# EAGLE schematic 18650_tester_5 (EAGLE 9.6.2)
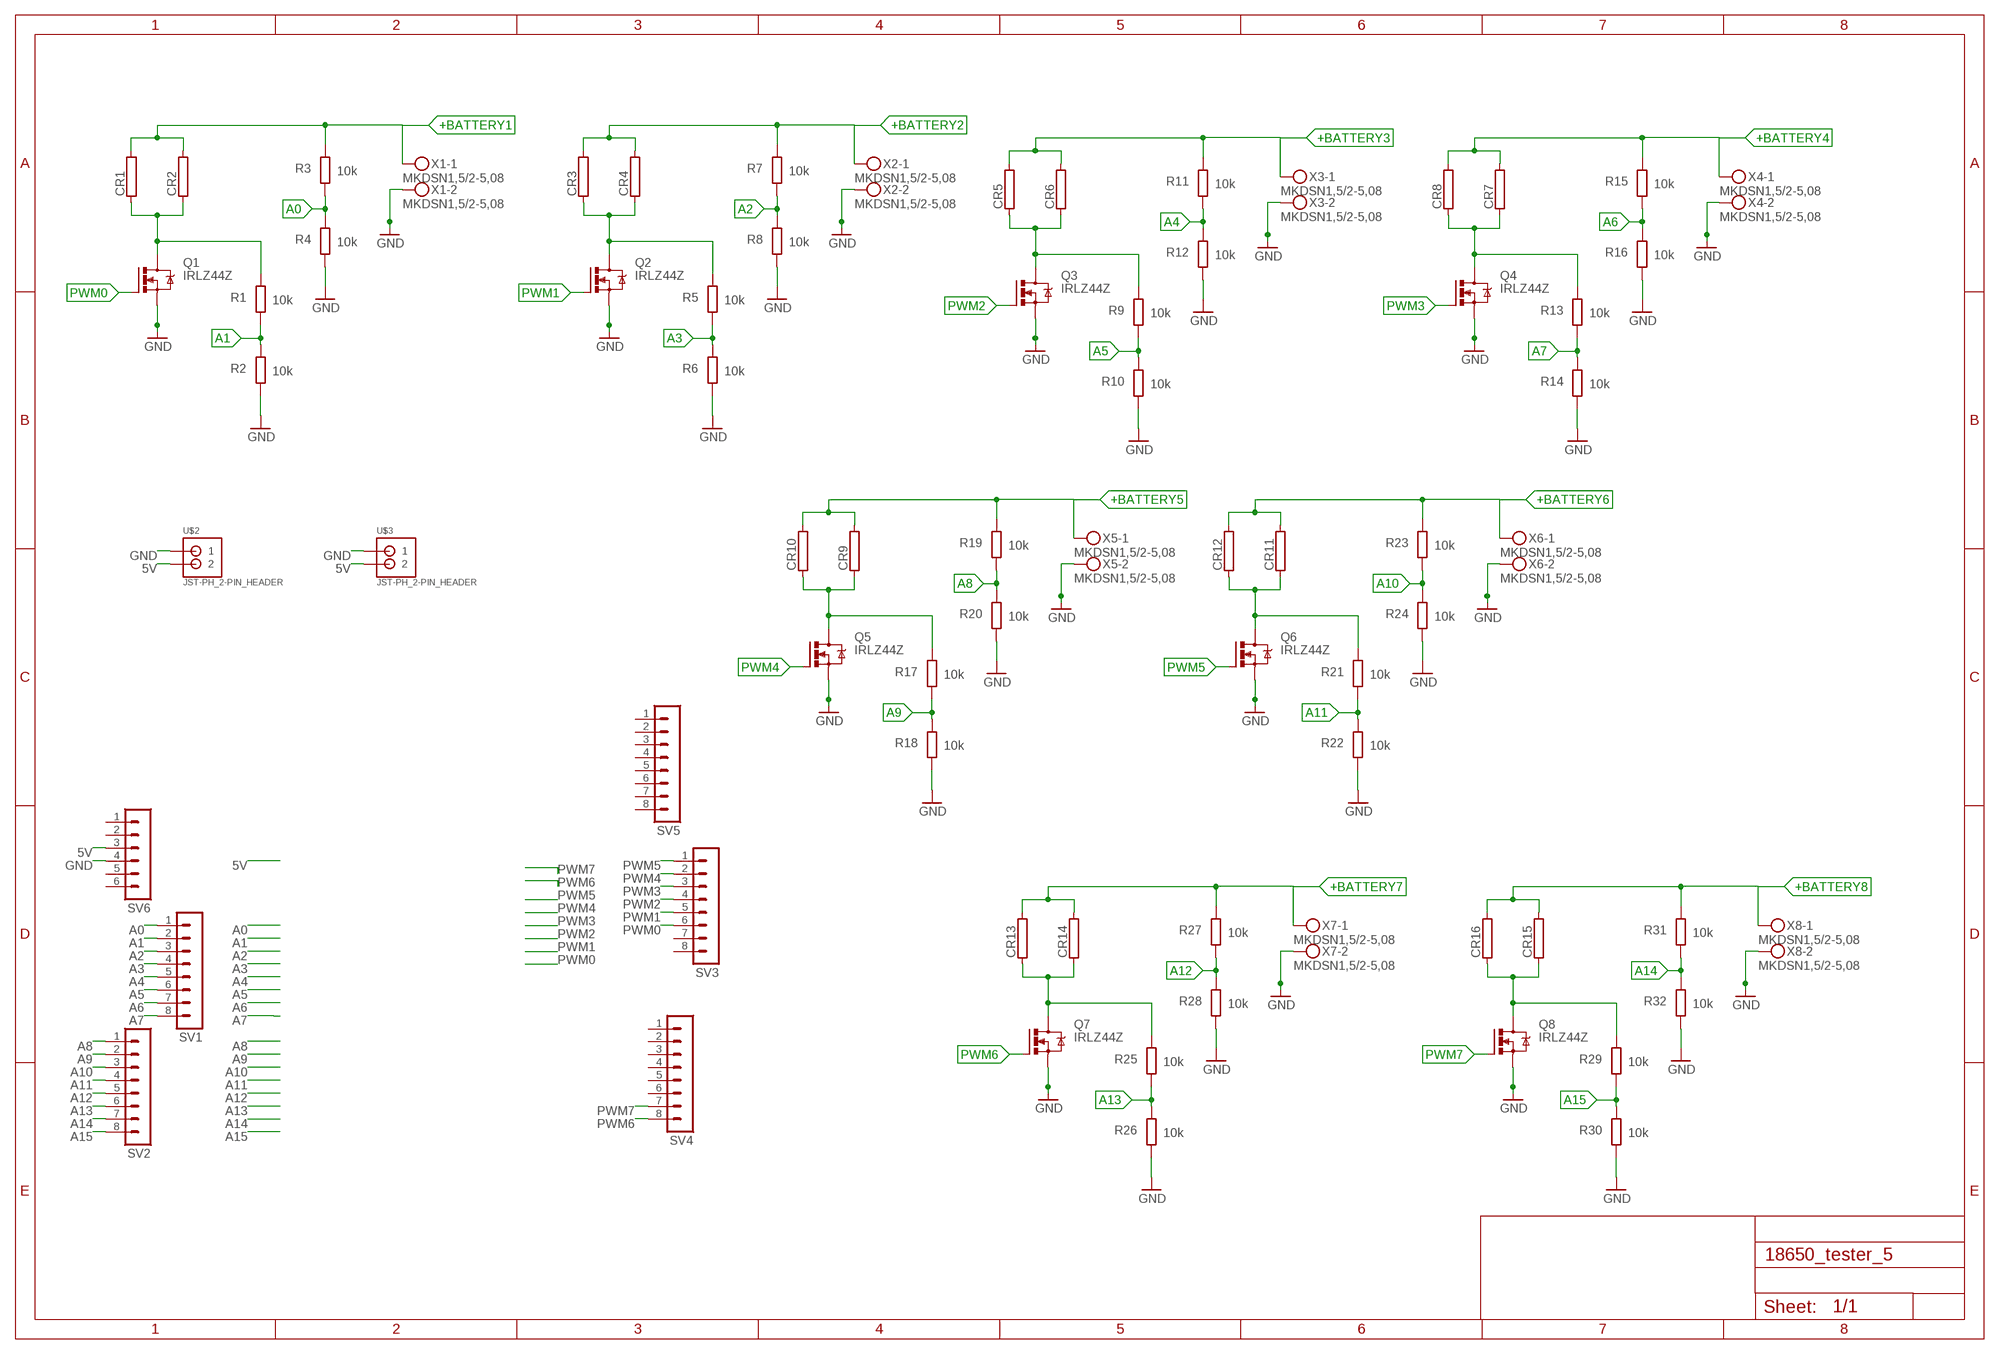
[diagram p0: schematic, sheet 1]

## Parts
CR1  RRWM6X22  [RWM6X22]
CR2  RRWM6X22  [RWM6X22]
CR3  RRWM6X22  [RWM6X22]
CR4  RRWM6X22  [RWM6X22]
CR5  RRWM6X22  [RWM6X22]
CR6  RRWM6X22  [RWM6X22]
CR7  RRWM6X22  [RWM6X22]
CR8  RRWM6X22  [RWM6X22]
CR9  RRWM6X22  [RWM6X22]
CR10  RRWM6X22  [RWM6X22]
CR11  RRWM6X22  [RWM6X22]
CR12  RRWM6X22  [RWM6X22]
CR13  RRWM6X22  [RWM6X22]
CR14  RRWM6X22  [RWM6X22]
CR15  RRWM6X22  [RWM6X22]
CR16  RRWM6X22  [RWM6X22]
Q1  IRLZ44Z  [TO220BH]
Q2  IRLZ44Z  [TO220BH]
Q3  IRLZ44Z  [TO220BH]
Q4  IRLZ44Z  [TO220BH]
Q5  IRLZ44Z  [TO220BH]
Q6  IRLZ44Z  [TO220BH]
Q7  IRLZ44Z  [TO220BH]
Q8  IRLZ44Z  [TO220BH]
R1  10k  R-EU_M1206  [M1206]
R2  10k  R-EU_M1206  [M1206]
R3  10k  R-EU_M1206  [M1206]
R4  10k  R-EU_M1206  [M1206]
R5  10k  R-EU_M1206  [M1206]
R6  10k  R-EU_M1206  [M1206]
R7  10k  R-EU_M1206  [M1206]
R8  10k  R-EU_M1206  [M1206]
R9  10k  R-EU_M1206  [M1206]
R10  10k  R-EU_M1206  [M1206]
R11  10k  R-EU_M1206  [M1206]
R12  10k  R-EU_M1206  [M1206]
R13  10k  R-EU_M1206  [M1206]
R14  10k  R-EU_M1206  [M1206]
R15  10k  R-EU_M1206  [M1206]
R16  10k  R-EU_M1206  [M1206]
R17  10k  R-EU_M1206  [M1206]
R18  10k  R-EU_M1206  [M1206]
R19  10k  R-EU_M1206  [M1206]
R20  10k  R-EU_M1206  [M1206]
R21  10k  R-EU_M1206  [M1206]
R22  10k  R-EU_M1206  [M1206]
R23  10k  R-EU_M1206  [M1206]
R24  10k  R-EU_M1206  [M1206]
R25  10k  R-EU_M1206  [M1206]
R26  10k  R-EU_M1206  [M1206]
R27  10k  R-EU_M1206  [M1206]
R28  10k  R-EU_M1206  [M1206]
R29  10k  R-EU_M1206  [M1206]
R30  10k  R-EU_M1206  [M1206]
R31  10k  R-EU_M1206  [M1206]
R32  10k  R-EU_M1206  [M1206]
SV1  MA08-1  [MA08-1]
SV2  MA08-1  [MA08-1]
SV3  MA08-1  [MA08-1]
SV4  MA08-1  [MA08-1]
SV5  MA08-1  [MA08-1]
SV6  MA06-1  [MA06-1]
U$2  JST-PH_2-PIN_HEADER  [JST_B2B-PH_HEADER]
U$3  JST-PH_2-PIN_HEADER  [JST_B2B-PH_HEADER]
X1  MKDSN1,5/2-5,08  [MKDSN1,5/2-5,08]
X2  MKDSN1,5/2-5,08  [MKDSN1,5/2-5,08]
X3  MKDSN1,5/2-5,08  [MKDSN1,5/2-5,08]
X4  MKDSN1,5/2-5,08  [MKDSN1,5/2-5,08]
X5  MKDSN1,5/2-5,08  [MKDSN1,5/2-5,08]
X6  MKDSN1,5/2-5,08  [MKDSN1,5/2-5,08]
X7  MKDSN1,5/2-5,08  [MKDSN1,5/2-5,08]
X8  MKDSN1,5/2-5,08  [MKDSN1,5/2-5,08]

## Nets
5V: SV6.3 U$2.P2 U$3.P2
+BATTERY1: CR1.2 CR2.2 R3.2 X1.1
+BATTERY2: CR3.2 CR4.2 R7.2 X2.1
+BATTERY3: CR5.2 CR6.2 R11.2 X3.1
+BATTERY4: CR7.2 CR8.2 R15.2 X4.1
+BATTERY5: CR9.2 CR10.2 R19.2 X5.1
+BATTERY6: CR11.2 CR12.2 R23.2 X6.1
+BATTERY7: CR13.2 CR14.2 R27.2 X7.1
+BATTERY8: CR15.2 CR16.2 R31.2 X8.1
A0: R3.1 R4.2 SV1.1
A1: R1.1 R2.2 SV1.2
A2: R7.1 R8.2 SV1.3
A3: R5.1 R6.2 SV1.4
A4: R11.1 R12.2 SV1.5
A5: R9.1 R10.2 SV1.6
A6: R15.1 R16.2 SV1.7
A7: R13.1 R14.2 SV1.8
A8: R19.1 R20.2 SV2.1
A9: R17.1 R18.2 SV2.2
A10: R23.1 R24.2 SV2.3
A11: R21.1 R22.2 SV2.4
A12: R27.1 R28.2 SV2.5
A13: R25.1 R26.2 SV2.6
A14: R31.1 R32.2 SV2.7
A15: R29.1 R30.2 SV2.8
GND: Q1.S Q2.S Q3.S Q4.S Q5.S Q6.S Q7.S Q8.S R2.1 R4.1 R6.1 R8.1 R10.1 R12.1 R14.1 R16.1 R18.1 R20.1 R22.1 R24.1 R26.1 R28.1 R30.1 R32.1 SV6.4 U$2.P1 U$3.P1 X1.2 X2.2 X3.2 X4.2 X5.2 X6.2 X7.2 X8.2
N$1: CR3.1 CR4.1 Q2.D R5.2
N$2: CR5.1 CR6.1 Q3.D R9.2
N$3: CR1.1 CR2.1 Q1.D R1.2
N$4: CR7.1 CR8.1 Q4.D R13.2
N$5: CR9.1 CR10.1 Q5.D R17.2
N$6: CR11.1 CR12.1 Q6.D R21.2
N$7: CR13.1 CR14.1 Q7.D R25.2
N$8: CR15.1 CR16.1 Q8.D R29.2
PWM0: Q1.G SV3.6
PWM1: Q2.G SV3.5
PWM2: Q3.G SV3.4
PWM3: Q4.G SV3.3
PWM4: Q5.G SV3.2
PWM5: Q6.G SV3.1
PWM6: Q7.G SV4.8
PWM7: Q8.G SV4.7
Unconnected: SV3.7 SV3.8 SV4.1 SV4.2 SV4.3 SV4.4 SV4.5 SV4.6 SV5.1 SV5.2 SV5.3 SV5.4 SV5.5 SV5.6 SV5.7 SV5.8 SV6.1 SV6.2 SV6.5 SV6.6

## Library data of the parts
CR1-CR16 = resistor-power:R: Power Resitor; OC_FARNELL: unknown; OC_NEWARK: unknown
Q1-Q8 = IRLZ44N_moded:IRLZ44Z: N-Channel HEXFET® Power MOSFET Logic Level AUTOMOTIVE MOSFET Source: http://www.irf.com/product-info/datasheets/data/irlz44zpbf.pdf
R1-R32 = rcl:R-EU_: RESISTOR, European symbol; SPICEPREFIX: R
SV1-SV5 = con-lstb:MA08-1: PIN HEADER; OC_FARNELL: unknown; OC_NEWARK: unknown
SV6 = con-lstb:MA06-1: PIN HEADER; OC_FARNELL: unknown; OC_NEWARK: unknown
U$2 U$3 = srg:JST-PH_2-PIN_HEADER: 2-pin JST PH Shrouded Header, top entry P/N B2B-PH-K-S Mating connector PHR-2 Mating cable assembly: Sparkfun PRT-09914 <http://www.sparkfun.com/products/9914>
X1-X8 = con-phoenix-508:MKDSN1,5/2-5,08: MKDSN 1,5/ 2-5,08 Printklemme Nennstrom: 13,5 A Nennspannung: 250 V Rastermaß: 5,08 mm Polzahl: 2 Anschlussart: Schraubanschluss Montage: Löten Anschlussrichtung Leiter/Platine: 0 ° Artikelnummer: 1729128 Source: http://eshop.phoenixcontact.com .. 1729128.pdf